# Altium schematic sheet PowerConversion60-12.SchDoc
size A4; SheetNumber: 4; SheetTotal: 5; SPICEModelCacheAJXRZOQB: <root> / <DocumentId>AJXRZOQB</DocumentId> / </root>
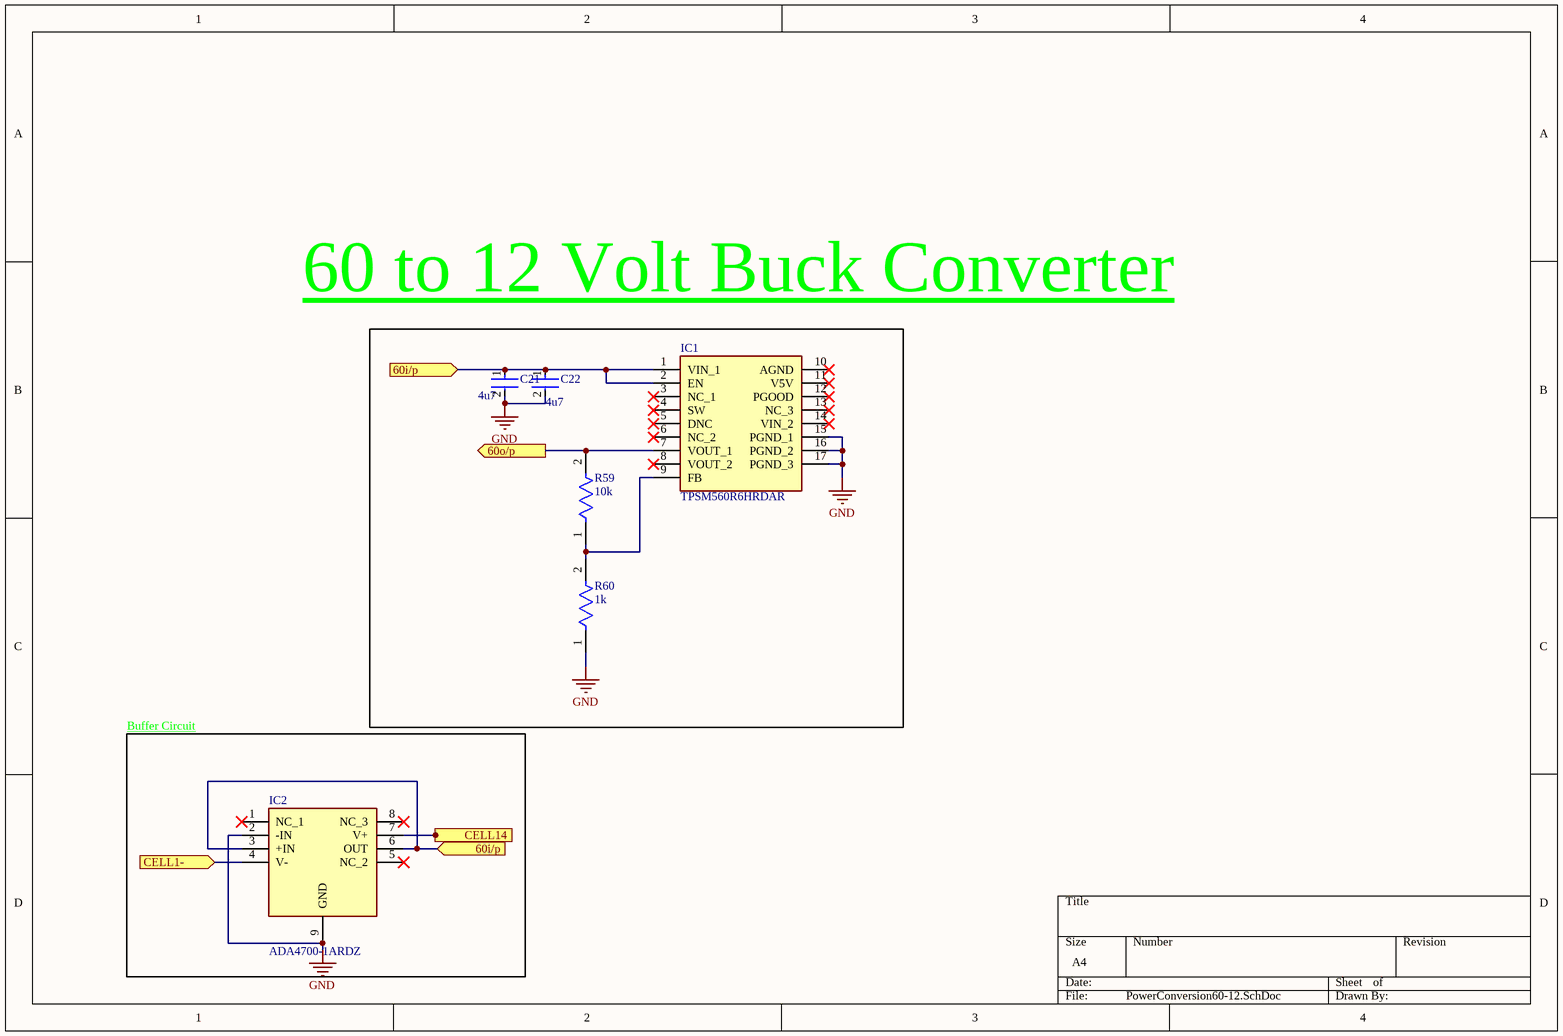
[diagram p0: PowerConversion60-12.SchDoc]

## Parts
C21  4u7  [FP-C2012-125-0_2-IPC_B]
C22  4u7  [FP-C2012-125-0_2-IPC_B]
IC1  TPSM560R6HRDAR  [TPSM5601R5HEXTRDAR]
IC2  ADA4700-1ARDZ  [SOIC127P600X175-9N]
R59  10k  [FP-RMCF0603-IPC_C]
R60  1k  [FP-RC0603-0_55-IPC_C]

## Blocks framed on the sheet
Buffer Circuit: IC2

## Ports
60i/p (in), 60o/p (out), CELL1- (in), CELL14 (in)

## Nets
GND: C21.2 C22.2 IC1.15(PGND_1) IC1.16(PGND_2) IC1.17(PGND_3) IC2.2(-IN) IC2.9(GND) R60.1
60i/p: C21.1 C22.1 IC1.1(VIN_1) IC1.2(EN) IC2.3(+IN) IC2.6(OUT) ; port 60i/p
60o/p: IC1.7(VOUT_1) R59.2 ; port 60o/p
CELL1-: IC2.4(V-) ; port CELL1-
CELL14: IC2.7(V+) ; port CELL14
NetIC1_9: IC1.9(FB) R59.1 R60.2

Not connected (* = marked no-connect by the designer): IC1 3(NC_1)* 4(SW)* 5(DNC)* 6(NC_2)* 8(VOUT_2)* 10(AGND)* 11(V5V)* 12(PGOOD)* 13(NC_3)* 14(VIN_2)*; IC2 1(NC_1)* 5(NC_2)* 8(NC_3)*

## Notes on the sheet
- 60 to 12 Volt Buck Converter <https://www.ti.com/lit/ds/symlink/tpsm560r6h.pdf?ts=1719150404230&ref_url=https%253A%252F%252Fwww.ti.com%252Fproduct%252FTPSM560R6H%253Fbm-verify%253DAAQAAAAJ_____9n9dYJofguQMvjVI7rZSMewwvPKBxHp2Y-vjDmY01ZDbjd4cvlE-ds_IrtiAyR4DSvqLB-Itj2OaEJczDdn57LFZa6zjmCaLKDPE-VkLOgK-coZHusrpuYlS4q8WgiMpFOloZsz4TrsJLkKB7QJ2a4dXp5PlHAmWaWAvaL1hmeFm7SiZdwb4Jts1Vs-uZu_rYv9UVYrP_cHo914ax203SwoCUAQ-HqOHmA3BSLpQnPbr1znfbTth-j-F-H1kXyQKUUhgVsZXDHjNjPahUIAYCnrdzWiqLnbTfDeszRffz51BZTDGQmW>

## Library data of the parts
C21 C22 = CMP-08246-000007-2: Multilayer Ceramic Capacitors 4.7μF ±10% 50V X5R SMD 0805; Capacitance: 4.7uF; Case Code (Metric): 2012; Weight: 0.000194oz; Voltage Rating: 50V; Voltage: 50V; Construction: Flat; Series: C; Packaging: Tape and Reel; Height: 1.25mm; Depth: 1.25mm; Resistor Type: Ceramic; Width: 0.049inch; Length: 2mm; Thickness: 0.057inch; REACH SVHC: No SVHC; Max Operating Temperature: 85°C; Case/Package: 0805; Dielectric: X5R; Tolerance: 10%; Dielectric Material: Ceramic; Package Quantity: 1; Mount: Surface Mount; Radiation Hardening: No; Voltage Rating (DC): 50V; Case Code (Imperial): 0805; Termination: SMD/SMT; Min Operating Temperature: -55°C; Lead Free: Lead Free
IC1 = TPSM560R6HRDAR: Integrated Circuit; Manufacturer_Name: Texas Instruments; Datasheet Link: https://www.arrow.com/en/products/tpsm560r6hrdar/texas-instruments?region=nac; Height: 4.1mm; Manufacturer_Part_Number: TPSM560R6HRDAR; Mouser Part Number: 595-TPSM560R6HRDAR; Mouser Price/Stock: https://www.mouser.co.uk/ProductDetail/Texas-Instruments/TPSM560R6HRDAR?qs=A6eO%252BMLsxmRvEyrhwThVzg%3D%3D; Arrow Part Number: TPSM560R6HRDAR; Arrow Price/Stock: https://www.arrow.com/en/products/tpsm560r6hrdar/texas-instruments?region=nac
IC2 = ADA4700-1ARDZ: Integrated Circuit; Manufacturer_Name: Analog Devices; Datasheet Link: https://www.analog.com/media/en/technical-documentation/data-sheets/ADA4700-1.pdf; Height: 1.75mm; Manufacturer_Part_Number: ADA4700-1ARDZ; Mouser Part Number: 584-ADA4700-1ARDZ; Mouser Price/Stock: https://www.mouser.co.uk/ProductDetail/Analog-Devices/ADA4700-1ARDZ?qs=TN6zvtaX%252BaMz68Bl9mo91A%3D%3D; Arrow Part Number: ADA4700-1ARDZ; Arrow Price/Stock: https://www.arrow.com/en/products/ada4700-1ardz/analog-devices?region=nac
R59 = CMP-26527-002098-1: 10kΩ ±5% 0.1W 0603 Thick Film Chip Resistor AEC-Q200 compliant; Power Rating: 100mW; Temperature Coefficient: 100ppm/°C; Resistance: 10kR; Radiation Hardening: No; Military Standard: Not; Mount: Surface Mount; Resistor Type: Thick Film; Size Code: 0603; Case/Package: 0603; Min Operating Temperature: -55°C; Construction: Rectangular; Series: RMCF; Width: 0.031inch; Length: 1.55mm; Case Code (Metric): 1608; Depth: 0.8mm; Height: 0.022inch; Packaging: Tape and Reel; Lead Free: Lead Free; Tolerance: 5%; Case Code (Imperial): 0603; Max Operating Temperature: 155°C; Contact Plating: Tin; Max Power Dissipation: 100mW; Features: Automotive AEC-Q200; Number of Terminations: 2
R60 = CMP-1659-00009-5: RES 1K OHM 1% 1/10W 0603; Resistance: 1kR; Voltage Rating: 50V; Power Rating: 100mW; Temperature Coefficient: 100ppm/°C; Military Standard: Not; REACH SVHC: No SVHC; Size Code: 0603; Features: Moisture Resistant; Number of Terminations: 2; Technology: THICK FILM; Series: RC; Case Code (Metric): 1608; Resistance Tolerance: 1%; Resistor Type: Thick Film; Termination: SMD/SMT; Contact Plating: Tin; Radiation Hardening: No; Min Operating Temperature: -55°C; Max Operating Temperature: 155°C; Packaging: Tape and Reel; Max Power Dissipation: 100mW; RoHS Compliant: Yes; Height: 0.45mm; Lead Free: Lead Free; Case/Package: 0603; Length: 1.6mm; Tolerance: 1%; Case Code (Imperial): 0603; Construction: Rectangular; Depth: 0.8mm